# EAGLE design adb (EAGLE 7.2.0)
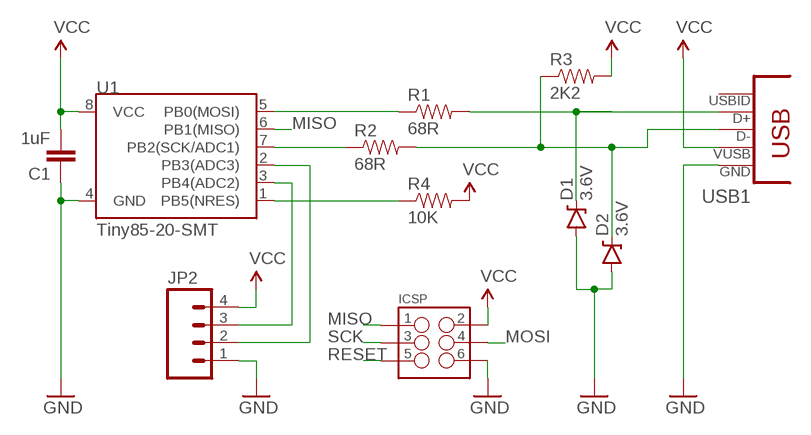
[diagram p0: schematic, sheet 1]

## Parts
C1  1uF  1.0UF-25V-+80/-20(0805)  [0805]
D1  3.6V  DIODE-ZENER3.3V  [SOD-323]
D2  3.6V  DIODE-ZENER3.3V  [SOD-323]
ICSP  M03X22X3_SILK_SM  [2X3]
JP2  M04PTH  [1X04]
R1  68R  RESISTOR0805-RES  [0805]
R2  68R  RESISTOR0805-RES  [0805]
R3  2K2  RESISTOR0805-RES  [0805]
R4  10K  RESISTOR0805-RES  [0805]
U1  Tiny85-20-SMT  ATTINY45TINY85-20-SMT  [SO08-EIAJ]
USB1  CON-USB-F-MICRO-B  [CONN_USB_MICRO-B]

## Nets
D+: D1.C R1.2 USB1.P3(D+)
D-: D2.C R2.2 R3.1 USB1.P2(D-)
GND: C1.1 D1.A D2.A ICSP.6 JP2.1 U1.4(GND) USB1.P5(GND)
MISO: ICSP.1 U1.6(PB1(MISO))
MOSI: ICSP.4 R1.1 U1.5(PB0(MOSI))
PB3: JP2.2 U1.2(PB3(ADC3))
PB4: JP2.3 U1.3(PB4(ADC2))
RESET: ICSP.5 R4.1 U1.1(PB5(NRES))
SCK: ICSP.3 R2.1 U1.7(PB2(SCK/ADC1))
VCC: C1.2 ICSP.2 JP2.4 R3.2 R4.2 U1.8(VCC) USB1.P1(VUSB)
Unconnected: USB1.BODY@1(BODY) USB1.BODY@2(BODY) USB1.BODY@3(BODY) USB1.BODY@4(BODY) USB1.P4(USBID)

## Library data of the parts
C1 = SparkFun-Capacitors:1.0UF-25V-+80/-20(0805): CAP-11625; PROD_ID: CAP-11625; VALUE: 1.0uF
D1 D2 = SparkFun-DiscreteSemi:DIODE-ZENER: Zener Diode Production Part - 8199 3.4V Zener Voltage; PROD_ID: DIO-11284; VALUE: 3.3V
ICSP = SparkFun-Connectors:M03X2: 2x3 .1" header. Shrouded, with keying- CONN-10681 SMT- CONN-11415 Pogo pins- HW-11044
JP2 = SparkFun-Connectors:M04: Header 4 Standard 4-pin 0.1" header. Use with straight break away headers (SKU : PRT-00116), right angle break away headers (PRT-00553), swiss pins (PRT-00743), machine pins (PRT-00117), and female headers (PRT-00115). Molex polarized connector foot print use with SKU : PRT-08231 with associated crimp pins and housings. 1MM SMD Version SKU: PRT-10208
R1-R4 = SparkFun-Passives:RESISTOR: Resistor Basic schematic elements and footprints for 0603, 1206, and PTH resistors.
U1 = SparkFun-DigitalIC:ATTINY45: Atmel 8-pin 2/4/8kB flash uC; PROD_ID: IC-09092
USB1 = dangerousprototypes_devices:CON-USB-F: USB Female connector

## Board
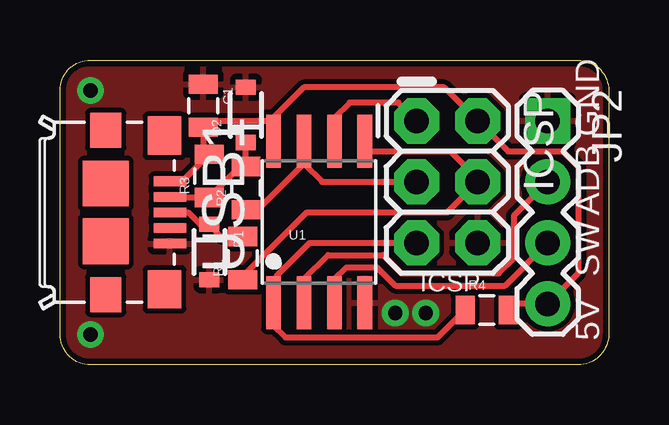
[diagram p1: board, top side]
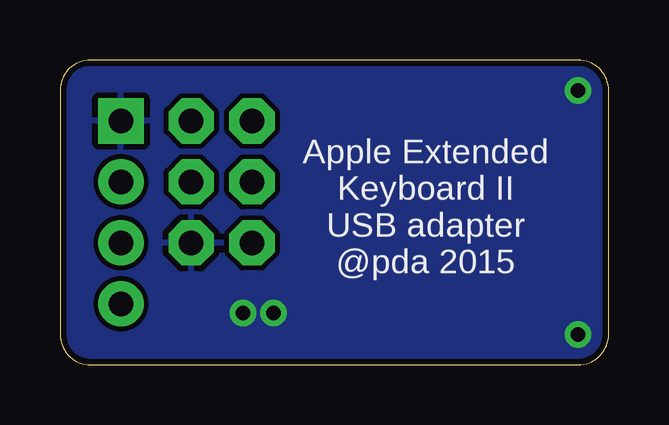
[diagram p2: board, bottom side, seen from below]

Size 22.86 x 12.7 mm. Coordinates in mm from the lower left corner, seen from the top.
Outline: 22.86,11.43 22.86,1.27 arc-90 21.59,0 1.27,0 arc-90 0,1.27 0,11.43 arc-90 1.27,12.7 21.59,12.7 arc-90 22.86,11.43
Copper layers (1*16): Top 0.035mm / dielectric 1.5mm / Bottom 0.035mm
Design rules "SparkFun": minimum track width 8mil, minimum drill 20mil, track to track 8mil, track to pad 8mil, pad to pad 8mil, via to via 8mil, smd to smd 8mil, copper to edge 10mil, drill to drill 8mil, minimum pad ring 12mil, minimum via ring 10mil, stop-mask expansion 4mil, vias tented up to drill 25mil, thermal gap 10mil

### Footprints (pad centres in the part's own frame; a part is rotated, then mirrored left to right if it is on the bottom)
0805 = smd 0.8 x 1.2: 1 -0.9,0; 2 0.9,0
SOD-323 = smd 0.63 x 0.83: A 1.15,0; C -1.15,0
2X3 = drill 1.016 pad 1.88 octagon: 1 0,0; 2 0,2.54; 3 2.54,0; 4 2.54,2.54; 5 5.08,0; 6 5.08,2.54
1X04 = drill 1.016 pad 1.88 square: 1 0,0 | drill 1.016 pad 1.88: 2 2.54,0; 3 5.08,0; 4 7.62,0
SO08-EIAJ = smd 0.61 x 2.21: 1 -1.905,-3.378; 2 -0.635,-3.378; 3 0.635,-3.378; 4 1.905,-3.378; 5 1.905,3.353; 6 0.635,3.353; 7 -0.635,3.353; 8 -1.905,3.353
CONN_USB_MICRO-B = smd 1.6 x 1.4: BODY@1 -3.2,2.45; BODY@2 3.2,2.45 | smd 1.45 x 1.3: BODY@3 3.425,0; BODY@6 -3.425,0 | smd 1.9 x 1.9: BODY@4 1.2,0; BODY@5 -1.2,0 | smd 0.4 x 1.35: P1 -1.3,2.675; P2 -0.65,2.675; P3 0,2.675; P4 0.65,2.675; P5 1.3,2.675

### Placement (x,y rotation side)
C1  5.97,10.79 270 top
D1  6.22,4.7 270 top
D2  7.75,10.41 90 top
ICSP  14.86,10.16 270 top
JP2  20.32,10.16 270 top
R1  7.62,4.45 90 top
R2  7.75,7.37 90 top
R3  6.22,7.87 90 top
R4  17.78,2.29 0 top
U1  10.79,5.97 0 top
USB1  1.91,6.35 270 top

### Tracks (layer width: path | path; a pad name or v marks a point on that pad's centre or on a via)
D+
  Top 0.254: R1.2 6.73,5.34 D1.C 5.83,5.85 5.33,6.35 USB1.P3
D-
  Top 0.254: USB1.P2 4.59,6.99 5.98,6.99 R3.1 7.64,8.39 R2.2 D2.C
GND  (via drill 0.6)
  other vias: 13.97,2.16 15.24,2.16 1.27,11.43 1.27,1.27
  pour Top: 0,12.7 0,0 22.86,0 22.86,12.7
  pour Bottom: 0,12.7 0,0 22.86,0 22.86,12.7
MISO
  Top 0.254: ICSP.1 14.1,10.92 12.06,10.92 11.43,10.29 U1.6
MOSI
  Top 0.254: R1.1 7.62,3.68 10.29,6.35 16.13,6.35 ICSP.4 17.4,7.75 16.26,8.89 12.95,8.89 U1.5
PB3
  Top 0.254: U1.2 10.16,3.56 11.18,4.57 13.46,4.57 14.22,3.81 18.29,3.81 18.92,4.45 18.92,6.22 JP2.2
PB4
  Top 0.254: U1.3 11.43,3.56 11.94,4.06 13.21,4.06 13.97,3.3 18.54,3.3 JP2.3
RESET
  Top 0.254: ICSP.5 10.41,5.08 9.02,3.68 9.02,3.56 8.89,3.43 U1.1 8.89,1.65 9.4,1.14 15.74,1.14 R4.1
SCK
  Top 0.254: 10.16,8.38 10.92,7.62 ICSP.3 | U1.7 10.16,8.38 | 10.16,8.38 8.37,6.59 R2.1
VCC
  Top 0.254: 8.89,9.53 U1.8 8.89,10.16 | 8.89,10.16 8.89,10.29 10.16,11.56 16,11.56 ICSP.2 18.67,8.89 20.95,8.89 21.59,8.26 21.59,3.81 JP2.4 18.93,2.54 R4.2 | USB1.P1 5.1,7.65 R3.2 5.97,9.03 C1.2 6.23,10.16 8.89,10.16

### Text on the board
_tsilk: GND | ADB | SW | ICSP | 5V
_bsilk: Apple Extended / Keyboard II / USB adapter / @pda 2015